# Altium schematic sheet MOASCT.SchDoc
size A3; SheetNumber: 1; SheetTotal: 1
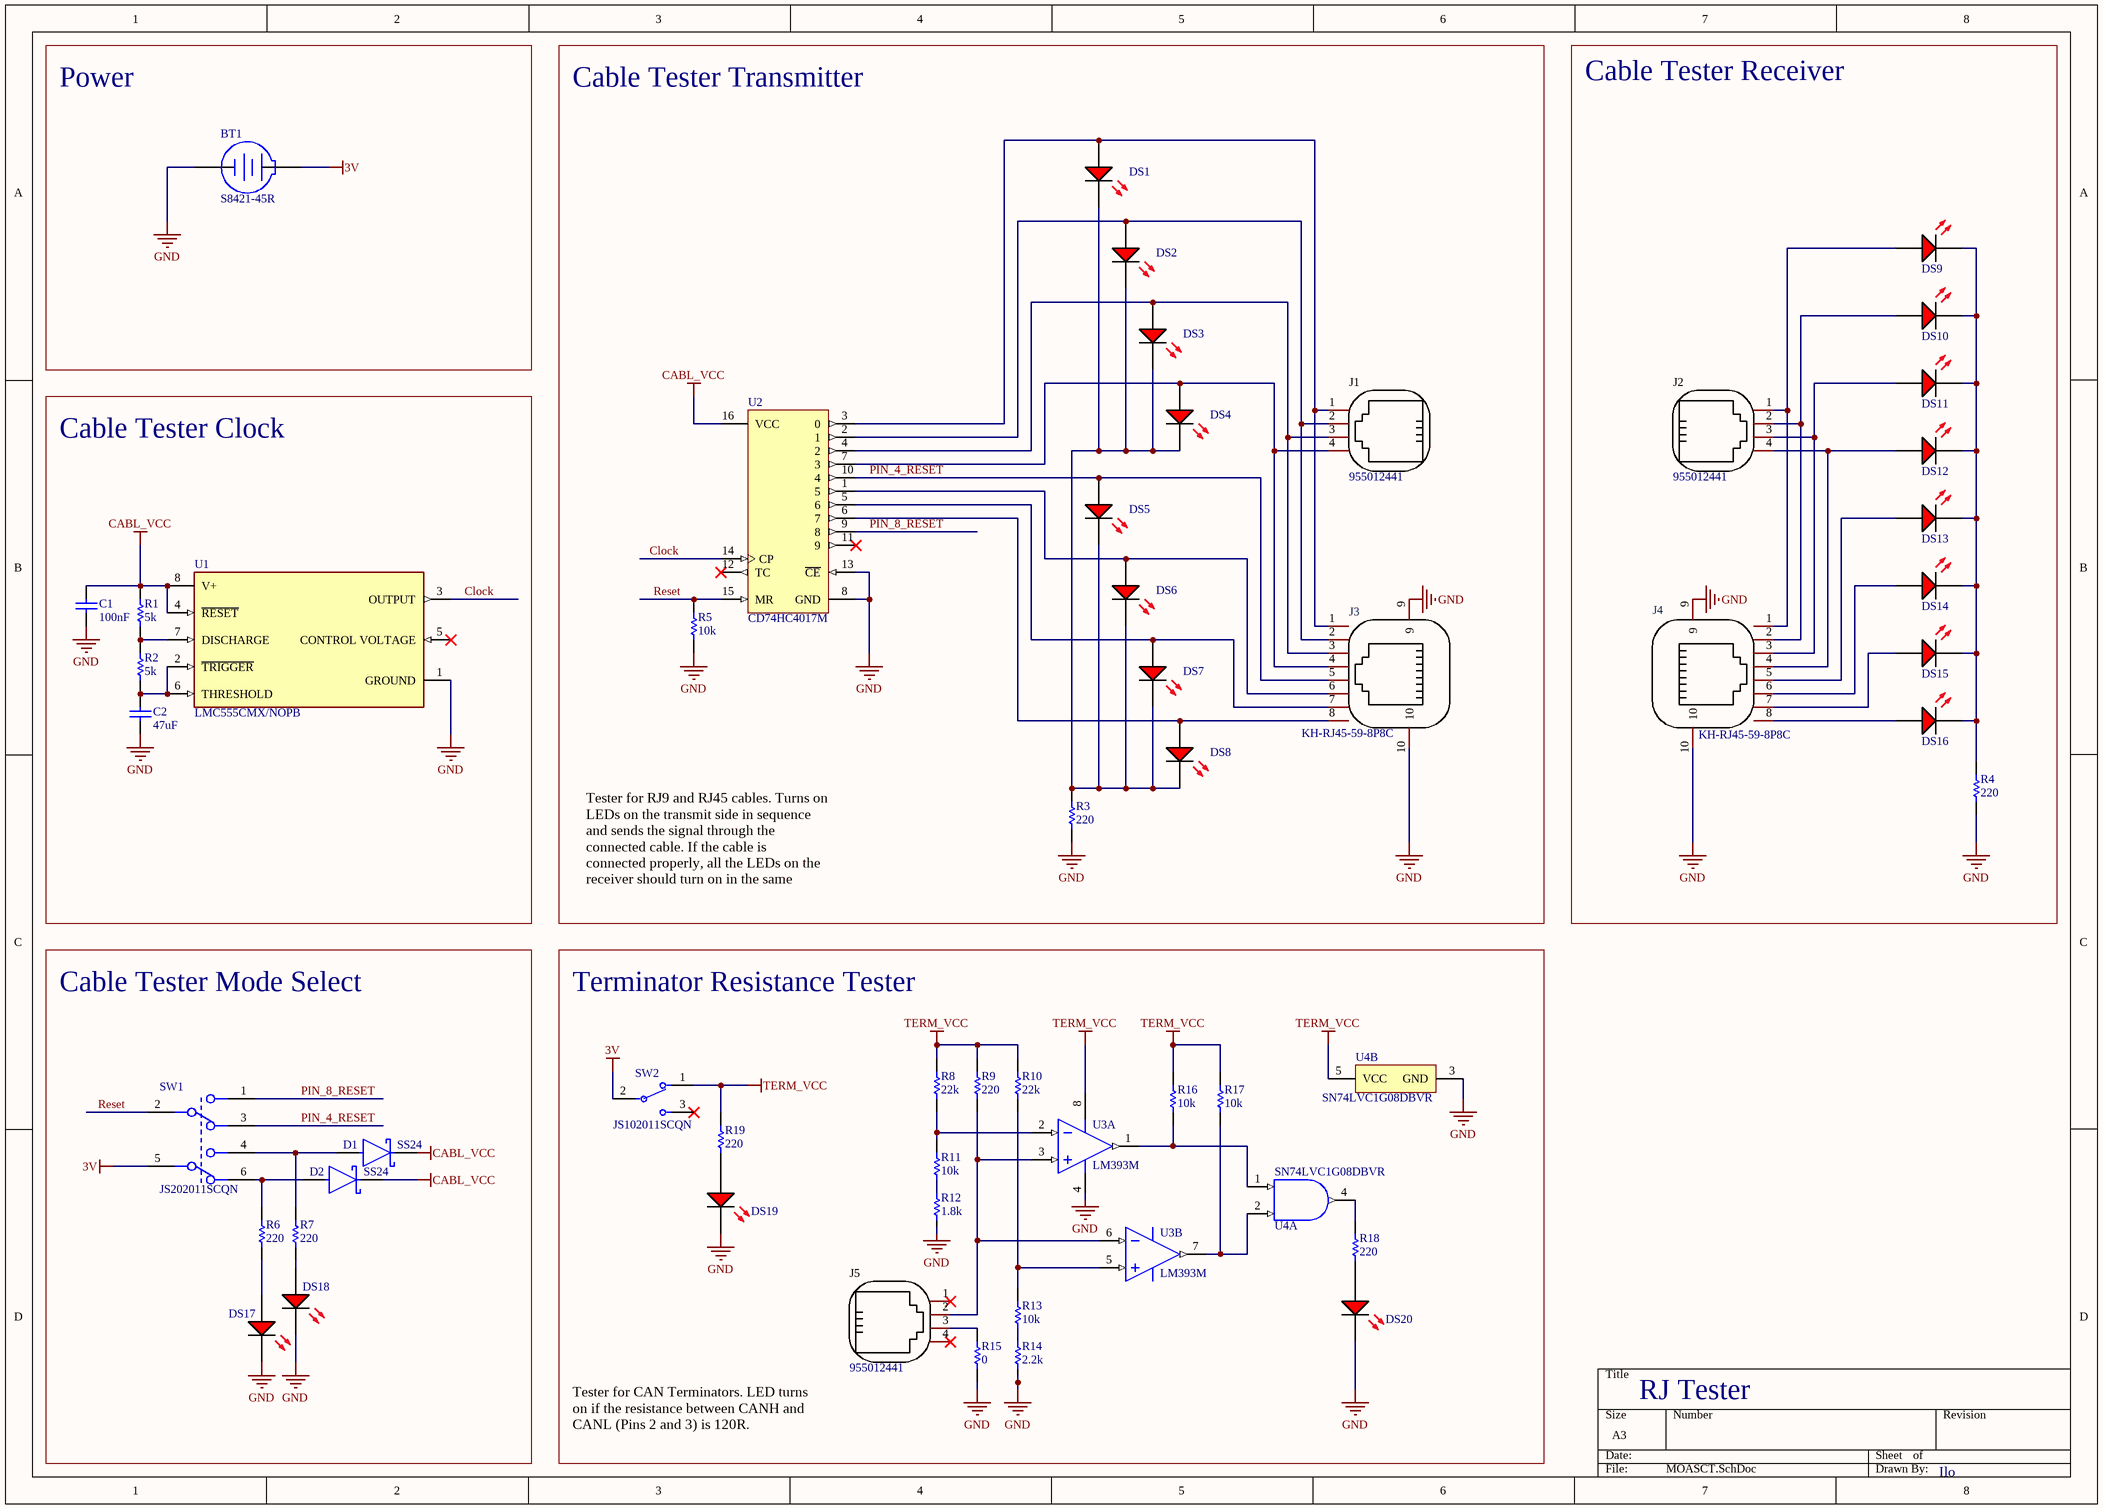
[diagram p0: MOASCT.SchDoc]

## Parts
BT1  S8421-45R  [HRWN-S8421-45R_V]
C1  100nF  [CAPC1608X92X38ML15T08]
C2  47uF  [CAPC2013X145X48NL20T23]
D1  SS24  [FP-95401-MFG]
D2  SS24  [FP-95401-MFG]
DS1  SML-LXT0805IW-TR  [LUMX-SML-LXT0805_V]  (value not drawn)
DS2  SML-LXT0805IW-TR  [LUMX-SML-LXT0805_V]  (value not drawn)
DS3  SML-LXT0805IW-TR  [LUMX-SML-LXT0805_V]  (value not drawn)
DS4  SML-LXT0805IW-TR  [LUMX-SML-LXT0805_V]  (value not drawn)
DS5  SML-LXT0805IW-TR  [LUMX-SML-LXT0805_V]  (value not drawn)
DS6  SML-LXT0805IW-TR  [LUMX-SML-LXT0805_V]  (value not drawn)
DS7  SML-LXT0805IW-TR  [LUMX-SML-LXT0805_V]  (value not drawn)
DS8  SML-LXT0805IW-TR  [LUMX-SML-LXT0805_V]  (value not drawn)
DS9  SML-LXT0805IW-TR  [LUMX-SML-LXT0805_V]  (value not drawn)
DS10  SML-LXT0805IW-TR  [LUMX-SML-LXT0805_V]  (value not drawn)
DS11  SML-LXT0805IW-TR  [LUMX-SML-LXT0805_V]  (value not drawn)
DS12  SML-LXT0805IW-TR  [LUMX-SML-LXT0805_V]  (value not drawn)
DS13  SML-LXT0805IW-TR  [LUMX-SML-LXT0805_V]  (value not drawn)
DS14  SML-LXT0805IW-TR  [LUMX-SML-LXT0805_V]  (value not drawn)
DS15  SML-LXT0805IW-TR  [LUMX-SML-LXT0805_V]  (value not drawn)
DS16  SML-LXT0805IW-TR  [LUMX-SML-LXT0805_V]  (value not drawn)
DS17  SML-LXT0805IW-TR  [LUMX-SML-LXT0805_V]  (value not drawn)
DS18  SML-LXT0805IW-TR  [LUMX-SML-LXT0805_V]  (value not drawn)
DS19  SML-LXT0805IW-TR  [LUMX-SML-LXT0805_V]  (value not drawn)
DS20  SML-LXT0805IW-TR  [LUMX-SML-LXT0805_V]  (value not drawn)
J1  955012441  [RJ45-TH_95501-2441]
J2  955012441  [RJ45-TH_95501-2441]
J3  KH-RJ45-59-8P8C  [RJ45-TH_KINGHELM_KH-RJ45-59-8P8C]
J4  KH-RJ45-59-8P8C  [RJ45-TH_KINGHELM_KH-RJ45-59-8P8C]
J5  955012441  [RJ45-TH_95501-2441]
R1  5k  [RESC1609X50X30ML10T20]
R2  5k  [RESC1609X50X30ML10T20]
R3  220  [RESC1609X50X30ML10T20]
R4  220  [RESC1609X50X30ML10T20]
R5  10k  [RESC1609X50X30ML10T20]
R6  220  [RESC1609X50X30ML10T20]
R7  220  [RESC1609X50X30ML10T20]
R8  22k  [RESC1609X50X30ML10T20]
R9  220  [RESC1609X50X30ML10T20]
R10  22k  [RESC1609X50X30ML10T20]
R11  10k  [RESC1609X50X30ML10T20]
R12  1.8k  [RESC1609X50X30ML10T20]
R13  10k  [RESC1609X50X30ML10T20]
R14  2.2k  [RESC1609X50X30ML10T20]
R15  0  [RESC1609X50X30ML10T20]
R16  10k  [RESC1609X50X30ML10T20]
R17  10k  [RESC1609X50X30ML10T20]
R18  220  [RESC1609X50X30ML10T20]
R19  220  [RESC1609X50X30ML10T20]
SW1  JS202011SCQN  [FP-JS202011SCQN-MFG]
SW2  JS102011SCQN  [FP-JS102011SCQN-MFG]
U1  LMC555CMX/NOPB  [FP-D0008A-MFG]
U2  CD74HC4017M  [D0016A_N]
U3  LM393M  [D0008A_L]  (parts A,B of 2)
U4  SN74LVC1G08DBVR  [DBV0005A_M]  (parts A,B of 2)

## Blocks framed on the sheet
Power: BT1
Cable Tester Transmitter: DS1-DS8 J1 J3 R3 R5 U2
Cable Tester Receiver: DS9-DS16 J2 J4 R4
Cable Tester Clock: C1 C2 R1 R2 U1
Cable Tester Mode Select: D1 D2 DS17 DS18 R6 R7 SW1
Terminator Resistance Tester: DS19 DS20 J5 R8-R19 SW2 U3 U4

## Nets
3V: BT1.1(+) SW1.5 SW2.2(C)
CABL_VCC: C1.2 D1.1(C) D2.1(C) R1.2 U1.4(~{RESET}) U1.8(V+) U2.16(VCC)
GND: BT1.2(-) C1.1 C2.2 DS17.2(K) DS18.2(K) DS19.2(K) DS20.2(K) J3.9 J3.10 J4.9 J4.10 R3.1 R4.1 R5.1 R12.1 R14.1 R15.1 U1.1(GROUND) U2.8(GND) U2.13(~{CE}) U3.4(GND) U4.3(GND)
TERM_VCC: R8.2 R9.2 R10.2 R16.2 R17.2 R19.2 SW2.1 U3.8(V+) U4.5(VCC)
Clock: U1.3(OUTPUT) U2.14(CP)
PIN_4_RESET: DS5.1(A) J3.5 SW1.3 U2.10(4)
PIN_8_RESET: SW1.1 U2.9(8)
Reset: R5.2 SW1.2 U2.15(MR)
NetC2_1: C2.1 R2.1 U1.2(~{TRIGGER}) U1.6(THRESHOLD)
NetD1_2: D1.2(A) R7.2 SW1.4
NetD2_2: D2.2(A) R6.2 SW1.6
NetDS1_1: DS1.1(A) J1.1 J3.1 U2.3(0)
NetDS1_2: DS1.2(K) DS2.2(K) DS3.2(K) DS4.2(K) DS5.2(K) DS6.2(K) DS7.2(K) DS8.2(K) R3.2
NetDS2_1: DS2.1(A) J1.2 J3.2 U2.2(1)
NetDS3_1: DS3.1(A) J1.3 J3.3 U2.4(2)
NetDS4_1: DS4.1(A) J1.4 J3.4 U2.7(3)
NetDS6_1: DS6.1(A) J3.6 U2.1(5)
NetDS7_1: DS7.1(A) J3.7 U2.5(6)
NetDS8_1: DS8.1(A) J3.8 U2.6(7)
NetDS9_1: DS9.1(A) J2.1 J4.1
NetDS9_2: DS9.2(K) DS10.2(K) DS11.2(K) DS12.2(K) DS13.2(K) DS14.2(K) DS15.2(K) DS16.2(K) R4.2
NetDS10_1: DS10.1(A) J2.2 J4.2
NetDS11_1: DS11.1(A) J2.3 J4.3
NetDS12_1: DS12.1(A) J2.4 J4.4
NetDS13_1: DS13.1(A) J4.5
NetDS14_1: DS14.1(A) J4.6
NetDS15_1: DS15.1(A) J4.7
NetDS16_1: DS16.1(A) J4.8
NetDS17_1: DS17.1(A) R6.1
NetDS18_1: DS18.1(A) R7.1
NetDS19_1: DS19.1(A) R19.1
NetDS20_1: DS20.1(A) R18.1
NetJ5_2: J5.2 R9.1 U3.3(INA+) U3.6(INB-)
NetJ5_3: J5.3 R15.2
NetR1_1: R1.1 R2.2 U1.7(DISCHARGE)
NetR8_1: R8.1 R11.2 U3.2(INA-)
NetR10_1: R10.1 R13.2 U3.5(INB+)
NetR11_1: R11.1 R12.2
NetR13_1: R13.1 R14.2
NetR16_1: R16.1 U3.1(OUTA) U4.1(A)
NetR17_1: R17.1 U3.7(OUTB) U4.2(B)
NetR18_2: R18.2 U4.4(Y)

Not connected (* = marked no-connect by the designer): J5 1* 4*; SW2 3*; U1 5(CONTROL_VOLTAGE)*; U2 11(9)* 12(TC)*

## Notes on the sheet
- Tester for RJ9 and RJ45 cables. Turns on LEDs on the transmit side in sequence and sends the signal through the connected cable. If the cable is connected properly, all the LEDs on the receiver should turn on in the same order.
- RJ Tester
- Tester for CAN Terminators. LED turns on if the resistance between CANH and CANL (Pins 2 and 3) is 120R.
- Ilo

## Library data of the parts
BT1 = CMP-2000-07028-1: Bettery Coin Cell Holder, Suitable for CR2032, -40 to 105 degC, 2-Pin SMD, RoHS, Tape and Reel; Manufacturer: Harwin; Number of Batteries: 1; Battery Cell Size: 20mm; RoHS: Details; Datasheet Version: Rev. 3, 01/2014; Dimensions: 20mm; Product: BatteryHolders; Datasheet URL: https://cdn.harwin.com/pdfs/S8421R.pdf; Package Reference: S8421-45R; Series: S8; Type: BatteryRetainer; Tradename: EZBoardware; Mounting Style: SMD/SMT; Factory Pack Quantity: 500; Package Description: 2-Pin Surface Mount Holder, Body 23.79 x 15.6 mm; Material: PolyphenyleneSulfide(PPS); Mounting Technology: SurfaceMount; Product Category: CoinCellBatteryHolders; Manufacturer URL: https://www.harwin.com/; Packaging: Reel; Brand: Harwin; Contact Plating: PhosphorBronze
C1 = CMP-2006-01972-1: Manufacturer: Vitramon; Part Number: VJ0603Y103KXAAC
C2 = CMP-2007-03168-1: Part Number: VJ0805Y104KXAAT; Manufacturer: Vitramon
D1 D2 = CMP-00030-42277690-1: SS24-E3/5BT Rectifier Diode, Schottky, 1 Phase, 1 Element, 2A, 40V V(RRM), Silicon, DO-214AA; Forward Voltage: 500mV; Max Reverse Leakage Current: 400µA; Max Forward Surge Current (Ifsm): 75A; Element Configuration: Single; NexarPartId: 42277690; Average Rectified Current: 2A; Max Operating Temperature: 125°C; Case/Package: SMB; Width: 3.8mm; Max Reverse Voltage (DC): 40V; Radiation Hardening: No; Length: 4.7mm; Peak Non-Repetitive Surge Current: 75A; Lead Free: Lead Free; Number of Pins: 2; Min Operating Temperature: -65°C; Max Surge Current: 75A; RoHS: Compliant; Max Repetitive Reverse Voltage (Vrrm): 40V; Mount: Surface Mount; Forward Current: 2A; Peak Reverse Current: 400µA; Contact Plating: Tin
DS1-DS20 = CMP-1724-00002-1: LED, RED, 635 nm, 2 V, -25 to 80 degC, 2-Pin SMD, RoHS, Tape and Reel; Case\/Package: 0805; ComponentLink2URL: http://www.lumex.com/content/files/ProductAttachment/219201631403-SML-LXT0805IW-TR.pdf; DatasheetVersion: Rev. F, 09/2009; Width: 1.25 mm; PackageReference: SML-LXT0805; Min Operating Temperature: -25 degC; Mounting Technology: Surface Mount; Packaging: Cut Tape; Case Code (Metric): 2012; RoHSCompliant: true; ComponentLink2Description: Datasheet; ComponentLink1Description: Manufacturer URL; ComponentLink1URL: http://www.lumexinstruments.com/; Mount: Surface Mount; Package Quantity: 1; PackageDescription: 2-Pin Surface Mount Device, Body 2 x 1.25 mm; Max Operating Temperature: 80 degC; REACH SVHC: No SVHC; Case Code (Imperial): 0805; Length: 2 mm
J1 J2 J5 = 955012441: Manufacturer: MOLEX; Add into BOM: yes; Number of Ports: 1; Symbol: 955012441; Device: 955012441; LCSC Part Name: 955012441; Supplier Part: C293727; Manufacturer Part: 955012441; Supplier Footprint: 插件; JLCPCB Part Class: Extended Part; Datasheet: https://atta.szlcsc.com/upload/public/pdf/source/20181030/C293728_4A841B363173D905FE7362B37B2768C3.pdf; Supplier: LCSC; Convert to PCB: yes; Connector Type: -; Shielding: -; LED: -; Ratings: -
J3 J4 = KH-RJ45-59-8P8C: Manufacturer: kinghelm(金航标); Add into BOM: yes; Connector Type: RJ45Receptacle; Number of Ports: 1; Shielding: 有屏蔽; LED: 不带LED; Symbol: KH-RJ45-59-8P8C; Device: KH-RJ45-59-8P8C; LCSC Part Name: 弯插 不带LED; Supplier Part: C2683358; Manufacturer Part: KH-RJ45-59-8P8C; Supplier Footprint: 插件; JLCPCB Part Class: Extended Part; Datasheet: https://atta.szlcsc.com/upload/public/pdf/source/20210106/C2683358_5AAB4F62BB451460BC65E4CF933F31C1.pdf; Supplier: LCSC; Convert to PCB: yes; Mounting Style: Right-Angle; Ratings: -; Operating Temperature Range: -
R1-R19 = CMP-2000-02920-1: Part Number: CRCW060315K0FKEA; Manufacturer: Vishay Dale
SW1 = CMP-2000-05087-3: SWITCH SLIDE DPDT 300MA 6V
SW2 = CMP-10038-000023-1: SWITCH SLIDE SPDT 300MA 6V; Actuator Material: Nylon; Actuator Length: 2mm; Actuator Color: Black; Contact Resistance: 70mR; Max Voltage Rating (DC): 30V; Actuator Type: Standard; Switch Function: On-On; Electrical Life: 5000Cycles; Throw Configuration: SPDT; Contact Plating: Silver; Min Operating Temperature: -40°C; RoHS Compliant: Yes; Contact Material: Copper Alloy; Package Quantity: 4000; Mount: Surface Mount; Radiation Hardening: No; Orientation: Straight; Series: JS; Current Rating: 300mA; Termination: Gull Wing; Depth: 7.5mm; Switch Travel: 2mm; Max Current Rating: 300mA; Packaging: Tape and Reel; Length: 8.5mm; Housing Material: Nylon; Max Operating Temperature: 85°C; Case/Package: SMD/SMT; Voltage Rating (DC): 6V
U1 = CMP-04858-000001-1: IC OSC SINGLE TIMER 3MHZ 8-SOIC; Manufacturer: Texas Instruments; Number Of Timers/Counters: 1; Max Supply Voltage: 15V; Standoff Height: 0.11mm; Propagation Delay: 100ns; Nominal Supply Current: 50-150uA; Min Supply Voltage: 1.5V; Octopart: https://octopart.com/lmc555cmx%2Fnopb-texas+instruments-24815227; Frequency: 3MHz; Device Class L2: Clock and Timing; Temperature: -40°C to +85°C; Temperature Range Low: -40°C; Height: 1.75mm; ComponentLink2URL: http://www.ti.com/general/docs/suppproductinfo.tsp?distId=10&gotoUrl=http%3A%2F%2Fwww.ti.com%2Flit%2Fgpn%2Flmc555; Package: D0008A; Device Class L1: Integrated Circuits (ICs); Manufacturer Part Number: LMC555CMX/NOPB; RoHS: TRUE; Lead Free: Yes; Temperature Range High: +85°C; Digikey Description: IC OSC SINGLE TIMER 3MHZ 8-SOIC; Device Class L3: Timers and Oscillators; ComponentLink2Description: Datasheet; Mouser Description: Timers & Support Products CMOS TIMER; Category: IC; Ipc Land Pattern Name: SOIC127P600X175-8; Automotive: No
U2 = CMP-1623-00115-2: High Speed CMOS Logic Decade Counter/Divider with 10 Decoded Outputs, D0016A, TUBE; Manufacturer: Texas Instruments; VCC(Max)(V): 6; Rating: Catalog; tpd @ Nom Voltage(Max)(ns): 54; ICC @ Nom Voltage(Max)(mA): 0.08; Technology Family: HC; VCC(Min)(V): 2; Input Type: LVTTL/CMOS; Schmitt Trigger: No; Voltage(Nom)(V): 3.3,5; Inputs: 1; Bits(#): 10; Output Drive (IOL/IOH)(Max)(mA): 5.2/-5.2; F @ Nom Voltage(Max)(Mhz): 28; Output Type: CMOS; Type: Decade; PackageReference: D0016A; DatasheetVersion: SCHS200D; Operating Temperature Range(C): -55 to 125; Function: Counter; Generic Part Number: CD74HC4017; Code_JEDEC: MS-012 variation AC
U3 = CMP-0055-00682-3: Low Power Low Offset Voltage Dual Comparator, 8-pin Narrow SOIC; Manufacturer: Texas Instruments; CompType: Amplifiers; PowerWise: N; PackageTopMarking: NSZXTT*LM*393M; PinCount: 8; Code_IPC: SOIC127P600-8; RoHS: N; PackageDescription: SOIC Narrow, 4.9 x 3.9 x 1.45mm, 8 Lead, 1.27mm Pitch; ComponentLink1URL: http://www.ti.com/general/docs/lit/getliterature.tsp?genericPartNumber=LM393-N&fileType=pdf; Code_JEDEC: MS-012-AA; ComponentLink1Description: Datasheet URL; Package Reference: D0008A
U4 = CMP-0859-00053-3: Single 2-Input Positive-AND Gate, DBV0005A, LARGE T&R; Manufacturer: Texas Instruments; Logic: True; ICC @ Nom Voltage(Max)(mA): 0.01; VCC(Min)(V): 1.65; Bits(#): 1; Rating: Catalog; Schmitt Trigger: No; Voltage(Nom)(V): 1.8,2.5,3.3,5; Output Drive (IOL/IOH)(Max)(mA): 32/-32; Gate Type: AND; tpd @ Nom Voltage(Max)(ns): 4.5,6,4,5; VCC(Max)(V): 5.5; Output Type: CMOS; F @ Nom Voltage(Max)(Mhz): 150; Input Type: CMOS/TTL; Technology Family: LVC; Sub-Family: AND Gate; PackageReference: DBV0005A; Generic Part Number: SN74LVC1G08; Operating Temperature Range(C): -40 to 125,-40 to 85; 3-State Output: No; DatasheetVersion: SCES217Y